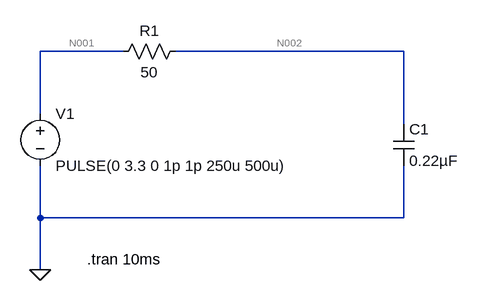
[diagram p0: schematic c1.asc]
c1.asc, the LTspice schematic file:
Version 4.1
SHEET 1 880 680
WIRE 224 -64 96 -64
WIRE 656 -64 304 -64
WIRE 96 32 96 -64
WIRE 656 48 656 -64
WIRE 96 192 96 112
WIRE 656 192 656 112
WIRE 656 192 96 192
WIRE 96 272 96 192
FLAG 96 272 0
SYMBOL voltage 96 16 R0
WINDOW 123 0 0 Left 0
WINDOW 39 0 0 Left 0
SYMATTR InstName V1
SYMATTR Value PULSE(0 3.3 0 1p 1p 250u 500u)
SYMBOL res 320 -80 R90
WINDOW 0 0 56 VBottom 2
WINDOW 3 32 56 VTop 2
SYMATTR InstName R1
SYMATTR Value 50
SYMBOL cap 640 48 R0
SYMATTR InstName C1
SYMATTR Value 0.22µF
TEXT 168 256 Left 2 !.tran 10ms

The netlist it stands for:
* c1.asc
V1 N001 0 PULSE(0 3.3 0 1p 1p 250u 500u)
R1 N002 N001 50
C1 N002 0 0.22µF
.tran 10ms
.backanno
.end

* Results of the author's LTspice run, read from the files saved beside the schematic
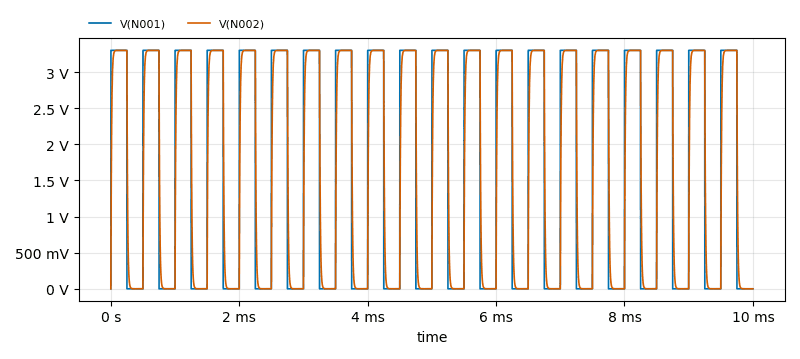
[diagram p1: Transient Analysis of c1.asc, plotted from the saved traces]
* Transient Analysis, 1 run:
*   V(N001): min 0 V, max 3.3 V, average 1.65 V, rms 2.333 V, last 0 V
*   V(N002): min 0 V, max 3.3 V, average 1.65 V, rms 2.283 V, last 0 V